# Altium project OpAmpDiffHS2.PRJPCB
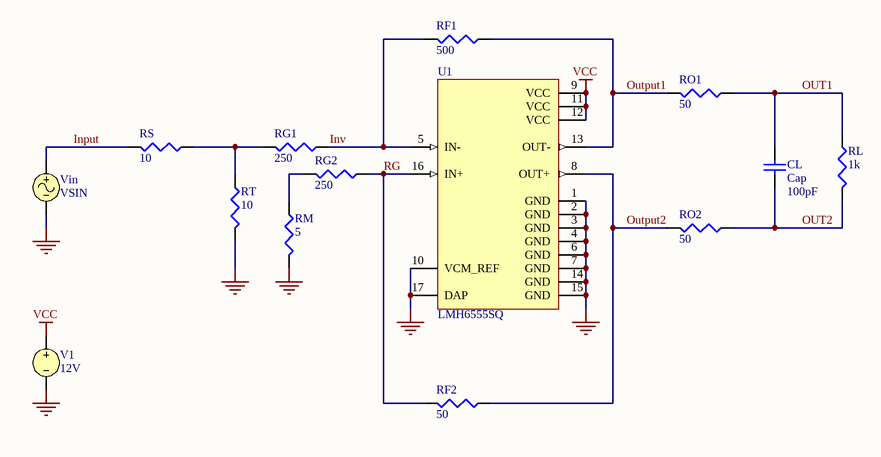
[diagram p0: OpAmpDiffHS2.schdoc]
1 sheet, 14 parts. Net scope: global (net labels, ports and power ports of the same name join across sheets).

## Sheet OpAmpDiffHS2.schdoc: Analog Amplifier
size A4; Organization: Altium Limited; Address1: L3, 12a Rodborough Rd; Address2: Frenchs Forest; Address3: NSW; Address4: Australia 2086; DocumentNumber: 1; SheetNumber: 1; SheetTotal: 1

### Parts
CL  Cap  value 100pF  [RAD-0.3]
RF1  value 500  (hidden comment: 100k)
RF2  value 50  (hidden comment: 100k)
RG1  value 250  (hidden comment: 10k)
RG2  value 250  (hidden comment: 10k)
RL  value 1k  (hidden comment: 25k)
RM  value 5  (hidden comment: 10k)
RO1  value 50  (hidden comment: 25k)
RO2  value 50  (hidden comment: 25k)
RS  value 10  (hidden comment: 10k)
RT  value 10  (hidden comment: 10k)
U1  LMH6555SQ  [SQA16A]
V1  12V
Vin  VSIN

### Nets
GND: RM.1(TOP) RT.1(TOP) U1.1(GND) U1.2(GND) U1.3(GND) U1.4(GND) U1.6(GND) U1.7(GND) U1.10(VCM_REF) U1.14(GND) U1.15(GND) U1.17(DAP) V1.2 Vin.2
VCC: U1.9(VCC) U1.11(VCC) U1.12(VCC) V1.1
Input: RS.1(TOP) Vin.1
Inv: RF1.1(TOP) RG1.2(BOT) U1.5(IN-)
OUT1: CL.2 RL.2(BOT) RO1.2(BOT)
OUT2: CL.1 RL.1(TOP) RO2.2(BOT)
Output1: RF1.2(BOT) RO1.1(TOP) U1.13(OUT-)
Output2: RF2.2(BOT) RO2.1(TOP) U1.8(OUT+)
RG: RF2.1(TOP) RG2.2(BOT) U1.16(IN+)
NetRG1_1: RG1.1(TOP) RS.2(BOT) RT.2(BOT)
NetRG2_1: RG2.1(TOP) RM.2(BOT)

### Notes on the sheet
- Title
- Size:
- Date:
- A4
- Number:
- Time:
- Revision:
- Sheet
- of
- File:

### Library data of the parts
CL = Cap: Capacitor; Published: 8-Jun-2000; LatestRevisionDate: 17-Jul-2002; LatestRevisionNote: Re-released for DXP Platform.; PackageReference: RAD-0.3; Publisher: Altium Limited
RF1 RF2 RG1 RG2 RL RM RO1 RO2 RS RT = RES: Resistor
U1 = LMH6555SQ: Low Distortion 1.2 GHz Differential Driver; Manufacturer: National Semiconductor; CompType: Amplifiers; PackageTopMarking: NS*UZXYTT*L6555SQ; DeviceFunction: Differential Amplifier; Published: 4-Dec-2008; DatasheetVersion: Dec-2007; PackageVersion: revA, Oct-2003; PackageReference: SQA16A; Publisher: Altium Limited; PackageDescription: LLP, Plastic, Quad, 4 x 4 x 0.8mm Body, 16 Lead, 0.5mm Pitch, No Pullback; PartNumber: LMH6555SQ; RoHS: Y; PinCount: 16; DigiKeyPartNumber: LMH6555SQCT-ND; ComponentLink1Description: LMH6555 Datasheet; ComponentLink1URL: http://www.national.com/ds/LM/LMH6555.pdf; ComponentLink2Description: LMH6555 Web Page; ComponentLink2URL: http://www.national.com/pf/LM/LMH6555.html; ComponentLink3Description: SQA16A Package Page; ComponentLink3URL: http://www.national.com/packaging/folders/sqa16a.html
V1 = VSRC: Voltage Source; Value: 12V
Vin = VSIN: Sinusoidal Voltage Source